# EAGLE design main (EAGLE 7.4.0)
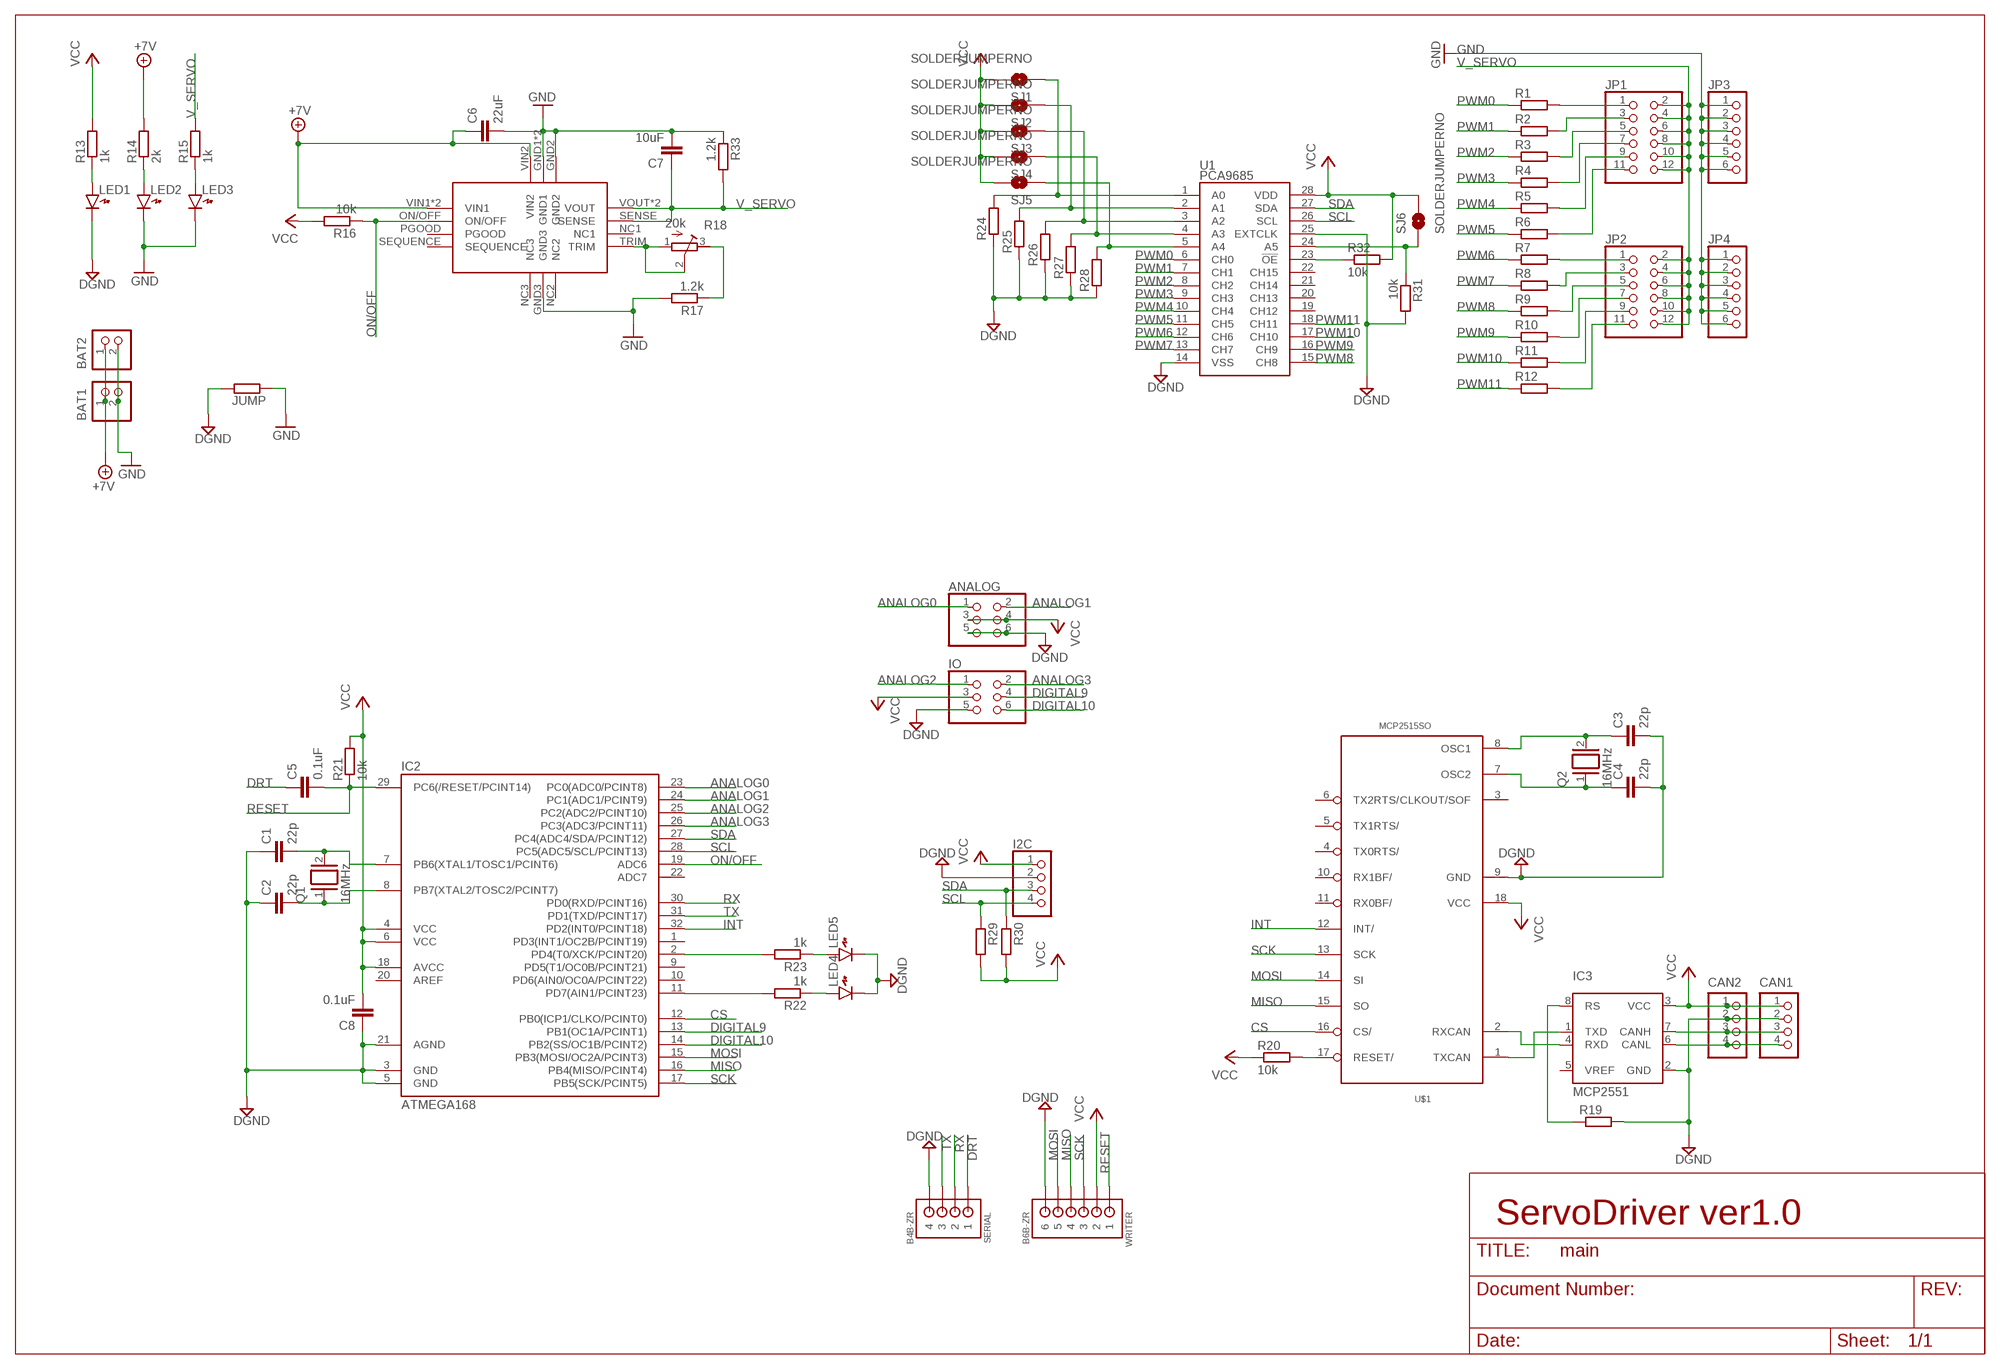
[diagram p0: schematic, sheet 1]

## Parts
ANALOG  PINHD-2X3  [2X03]
BAT1  B2P-VH  [B2P-VH]
BAT2  B2P-VH  [B2P-VH]
C1  22p  C-EUC2012  [C2012]
C2  22p  C-EUC2012  [C2012]
C3  22p  C-EUC2012  [C2012]
C4  22p  C-EUC2012  [C2012]
C5  0.1uF  C-EUC2012  [C2012]
C6  22uF  C-EUC2012  [C2012]
C7  10uF  C-EUC2012  [C2012]
C8  0.1uF  C-EUC2012  [C2012]
CAN1  B4B-PH-K-S  [B4B-PH-K-S]
CAN2  B4B-PH-K-S  [B4B-PH-K-S]
I2C  PINHD-1X4  [1X04]
IC1  OKL-T  [OKL-T]
IC2  ATMEGA168  ATMEGA48/88/168-AU  [TQFP32-08]
IC3  MCP2551  [SOIC]
IO  PINHD-2X3  [2X03]
JP1  PINHD-2X6  [2X06]
JP2  PINHD-2X6  [2X06]
JP3  PINHD-1X6  [1X06]
JP4  PINHD-1X6  [1X06]
JUMP  R-EU_M2012  [M2012]
LED1  LED2012  [LED2012]
LED2  LED2012  [LED2012]
LED3  LED2012  [LED2012]
LED4  LED2012  [LED2012]
LED5  LED2012  [LED2012]
Q1  16MHz  XTAL/S  [QS]
Q2  16MHz  XTAL/S  [QS]
R1  R-EU_M2012  [M2012]
R2  R-EU_M2012  [M2012]
R3  R-EU_M2012  [M2012]
R4  R-EU_M2012  [M2012]
R5  R-EU_M2012  [M2012]
R6  R-EU_M2012  [M2012]
R7  R-EU_M2012  [M2012]
R8  R-EU_M2012  [M2012]
R9  R-EU_M2012  [M2012]
R10  R-EU_M2012  [M2012]
R11  R-EU_M2012  [M2012]
R12  R-EU_M2012  [M2012]
R13  1k  R-EU_M2012  [M2012]
R14  2k  R-EU_M2012  [M2012]
R15  1k  R-EU_M2012  [M2012]
R16  10k  R-EU_M2012  [M2012]
R17  1.2k  R-EU_M2012  [M2012]
R18  20k  R-TRIMM64W  [RTRIM64W]
R19  R-EU_M2012  [M2012]
R20  10k  R-EU_M2012  [M2012]
R21  10k  R-EU_M2012  [M2012]
R22  1k  R-EU_M2012  [M2012]
R23  1k  R-EU_M2012  [M2012]
R24  R-EU_M2012  [M2012]
R25  R-EU_M2012  [M2012]
R26  R-EU_M2012  [M2012]
R27  R-EU_M2012  [M2012]
R28  R-EU_M2012  [M2012]
R29  R-EU_M2012  [M2012]
R30  R-EU_M2012  [M2012]
R31  10k  R-EU_M2012  [M2012]
R32  10k  R-EU_M2012  [M2012]
R33  1.2k  R-EU_M2012  [M2012]
SERIAL  B4B-ZR  [B4B-ZR]
SJ1  SOLDERJUMPERNO  [SJ_2S-NO]
SJ2  SOLDERJUMPERNO  [SJ_2S-NO]
SJ3  SOLDERJUMPERNO  [SJ_2S-NO]
SJ4  SOLDERJUMPERNO  [SJ_2S-NO]
SJ5  SOLDERJUMPERNO  [SJ_2S-NO]
SJ6  SOLDERJUMPERNO  [SJ_2S-NO]
U1  PCA9685  [TSSOP-28_4MM]
U$1  MCP2515SO  [SO18L]
WRITER  B6B-ZR  [B6B-ZR]

## Nets
+7V: BAT1.1 BAT2.1 C6.1 IC1.VIN1 IC1.VIN2 IC1.VIN_BRIDGE(VIN1) R14.2
ANALOG0: ANALOG.1 IC2.23(PC0(ADC0/PCINT8))
ANALOG1: ANALOG.2 IC2.24(PC1(ADC1/PCINT9))
ANALOG2: IC2.25(PC2(ADC2/PCINT10)) IO.1
ANALOG3: IC2.26(PC3(ADC3/PCINT11)) IO.2
CS: IC2.12(PB0(ICP1/CLKO/PCINT0)) U$1.16(CS/)
DGND: ANALOG.5 ANALOG.6 C1.1 C2.1 C3.2 C4.2 C8.1 CAN1.2 CAN2.2 I2C.2 IC2.3(GND) IC2.5(GND) IC2.21(AGND) IC3.2(GND) IO.5 JUMP.2 LED1.K LED4.K LED5.K R19.2 R24.1 R25.1 R26.1 R27.1 R28.1 R31.2 SERIAL.4 U1.14(VSS) U1.25(EXTCLK) U$1.9(GND) WRITER.6
DIGITAL9: IC2.13(PB1(OC1A/PCINT1)) IO.4
DIGITAL10: IC2.14(PB2(SS/OC1B/PCINT2)) IO.6
DRT: C5.1 SERIAL.1
GND: BAT1.2 BAT2.2 C6.2 C7.2 IC1.GND1 IC1.GND2 IC1.GND3 IC1.GND_BRIDGE(GND1) JP3.1 JP3.2 JP3.3 JP3.4 JP3.5 JP3.6 JP4.1 JP4.2 JP4.3 JP4.4 JP4.5 JP4.6 JUMP.1 LED2.K LED3.K R17.2 R33.1
INT: IC2.32(PD2(INT0/PCINT18)) U$1.12(INT/)
MISO: IC2.16(PB4(MISO/PCINT4)) U$1.15(SO) WRITER.4
MOSI: IC2.15(PB3(MOSI/OC2A/PCINT3)) U$1.14(SI) WRITER.5
N$1: JP1.1 R1.2
N$2: JP1.3 R2.2
N$3: JP1.5 R3.2
N$4: JP1.7 R4.2
N$5: JP1.9 R5.2
N$6: JP1.11 R6.2
N$7: JP2.1 R7.2
N$8: JP2.3 R8.2
N$9: JP2.5 R9.2
N$10: JP2.7 R10.2
N$11: JP2.9 R11.2
N$12: JP2.11 R12.2
N$13: LED1.A R13.1
N$14: LED2.A R14.1
N$15: LED3.A R15.1
N$16: IC1.TRIM R18.1(A) R18.2(S)
N$17: R17.1 R18.3(E)
N$18: C2.2 IC2.8(PB7(XTAL2/TOSC2/PCINT7)) Q1.1
N$19: R24.2 SJ1.1 U1.1(A0)
N$20: C1.2 IC2.7(PB6(XTAL1/TOSC1/PCINT6)) Q1.2
N$21: IC3.1(TXD) U$1.1(TXCAN)
N$22: IC3.4(RXD) U$1.2(RXCAN)
N$23: IC3.8(RS) R19.1
N$24: CAN1.3 CAN2.3 IC3.7(CANH)
N$25: CAN1.4 CAN2.4 IC3.6(CANL)
N$26: C4.1 Q2.1 U$1.7(OSC2)
N$27: C3.1 Q2.2 U$1.8(OSC1)
N$28: R25.2 SJ2.1 U1.2(A1)
N$29: R26.2 SJ3.1 U1.3(A2)
N$30: R27.2 SJ4.1 U1.4(A3)
N$31: IC2.2(PD4(T0/XCK/PCINT20)) R23.2
N$32: R28.2 SJ5.1 U1.5(A4)
N$33: R32.1 U1.23(!OE)
N$34: R20.2 U$1.17(RESET/)
N$35: IC2.11(PD7(AIN1/PCINT23)) R22.2
N$36: LED4.A R22.1
N$37: LED5.A R23.1
N$39: R31.1 SJ6.1 U1.24(A5)
ON/OFF: IC1.ON/OFF IC2.19(ADC6) R16.1
PWM0: R1.1 U1.6(CH0)
PWM1: R2.1 U1.7(CH1)
PWM2: R3.1 U1.8(CH2)
PWM3: R4.1 U1.9(CH3)
PWM4: R5.1 U1.10(CH4)
PWM5: R6.1 U1.11(CH5)
PWM6: R7.1 U1.12(CH6)
PWM7: R8.1 U1.13(CH7)
PWM8: R9.1 U1.15(CH8)
PWM9: R10.1 U1.16(CH9)
PWM10: R11.1 U1.17(CH10)
PWM11: R12.1 U1.18(CH11)
RESET: C5.2 IC2.29(PC6(/RESET/PCINT14)) R21.1 WRITER.1
RX: IC2.30(PD0(RXD/PCINT16)) SERIAL.2
SCK: IC2.17(PB5(SCK/PCINT5)) U$1.13(SCK) WRITER.3
SCL: I2C.4 IC2.28(PC5(ADC5/SCL/PCINT13)) R29.1 U1.26(SCL)
SDA: I2C.3 IC2.27(PC4(ADC4/SDA/PCINT12)) R30.1 U1.27(SDA)
TX: IC2.31(PD1(TXD/PCINT17)) SERIAL.3
V_SERVO: C7.1 IC1.SENSE IC1.VOUT IC1.VOUT_BRIDGE(VOUT) JP1.2 JP1.4 JP1.6 JP1.8 JP1.10 JP1.12 JP2.2 JP2.4 JP2.6 JP2.8 JP2.10 JP2.12 R15.2 R33.2
VCC: ANALOG.3 ANALOG.4 C8.2 CAN1.1 CAN2.1 I2C.1 IC2.4(VCC) IC2.6(VCC) IC2.18(AVCC) IC3.3(VCC) IO.3 R13.2 R16.2 R20.1 R21.2 R29.2 R30.2 R32.2 SJ1.2 SJ2.2 SJ3.2 SJ4.2 SJ5.2 SJ6.2 U1.28(VDD) U$1.18(VCC) WRITER.2
Unconnected: IC1.NC1 IC1.NC2 IC1.NC3 IC1.PGOOD IC1.SEQUENCE IC2.1(PD3(INT1/OC2B/PCINT19)) IC2.9(PD5(T1/OC0B/PCINT21)) IC2.10(PD6(AIN0/OC0A/PCINT22)) IC2.20(AREF) IC2.22(ADC7) IC3.5(VREF) U1.19(CH12) U1.20(CH13) U1.21(CH14) U1.22(CH15) U$1.3(CLKOUT/SOF) U$1.4(TX0RTS/) U$1.5(TX1RTS/) U$1.6(TX2RTS/) U$1.10(RX1BF/) U$1.11(RX0BF/)

## Notes on the sheet
- ServoDriver ver1.0

## Library data of the parts
ANALOG IO = pinhead:PINHD-2X3: PIN HEADER
BAT1 BAT2 = jst-vh:B2P-VH: Wire-to-Board 3.96mm pitch top mount connector Source: http://www.jst-mfg.com/product/pdf/jpn/VH.pdf http://www.jst-mfg.com/product/detail.php?series=262
C1-C8 = resistor:C-EU: CAPACITOR, European symbol
CAN1 CAN2 = jst-ph:B4B-PH-*: Wire-to-Board 2.0mm pitch top mount connector Source: http://www.jst-mfg.com/product/pdf/jpn/PH.pdf http://www.jst-mfg.com/product/detail.php?series=199
I2C = pinhead:PINHD-1X4: PIN HEADER
IC1 = OKL-T:OKL-T
IC2 = atmega8:ATMEGA48/88/168
IC3 = mcp2551:MCP2551
JP1 JP2 = pinhead:PINHD-2X6: PIN HEADER
JP3 JP4 = pinhead:PINHD-1X6: PIN HEADER
JUMP R1-R17 R19-R33 = resistor:R-EU_: RESISTOR, European symbol
LED1-LED5 = generic:LED: Generic LEDs
Q1 Q2 = special:XTAL/S: CRYSTAL
R18 = resistor:R-TRIMM: Trimm resistor
SERIAL = jst:B4B-ZR: JST-ZH Connector 4 pol, 1.5mm pitch Package: B4B-ZR Source: http://www.jst-mfg.com/product/pdf/eng/eZH.pdf
SJ1-SJ6 = SparkFun-Retired:SOLDERJUMPER: Solder Jumper Standard SMD solder jumper. Used to automate production. Two varients : Normally Open and Normally Closed are the same, but have different paste layers. NC will have a large amount of paste and should jumper during reflow.
U1 = SparkFun-DigitalIC:PCA9685: 16-channel 12-bit PWM I2C interface Internal Oscillator 40Hz to 1kHz Can be totem pole or open collector 2.3V to 5.5V; PROD_ID: IC-12240
U$1 = MCP2515_MT:MCP2515*: MCP2515 Standalone CAN-Controller by Microchip Eagle-Lib. by MartinThomas
WRITER = jst:B6B-ZR: JST-ZH Connector 6 pol, 1.5mm pitch Package: B6B-ZR Source: http://www.jst-mfg.com/product/pdf/eng/eZH.pdf

## Board
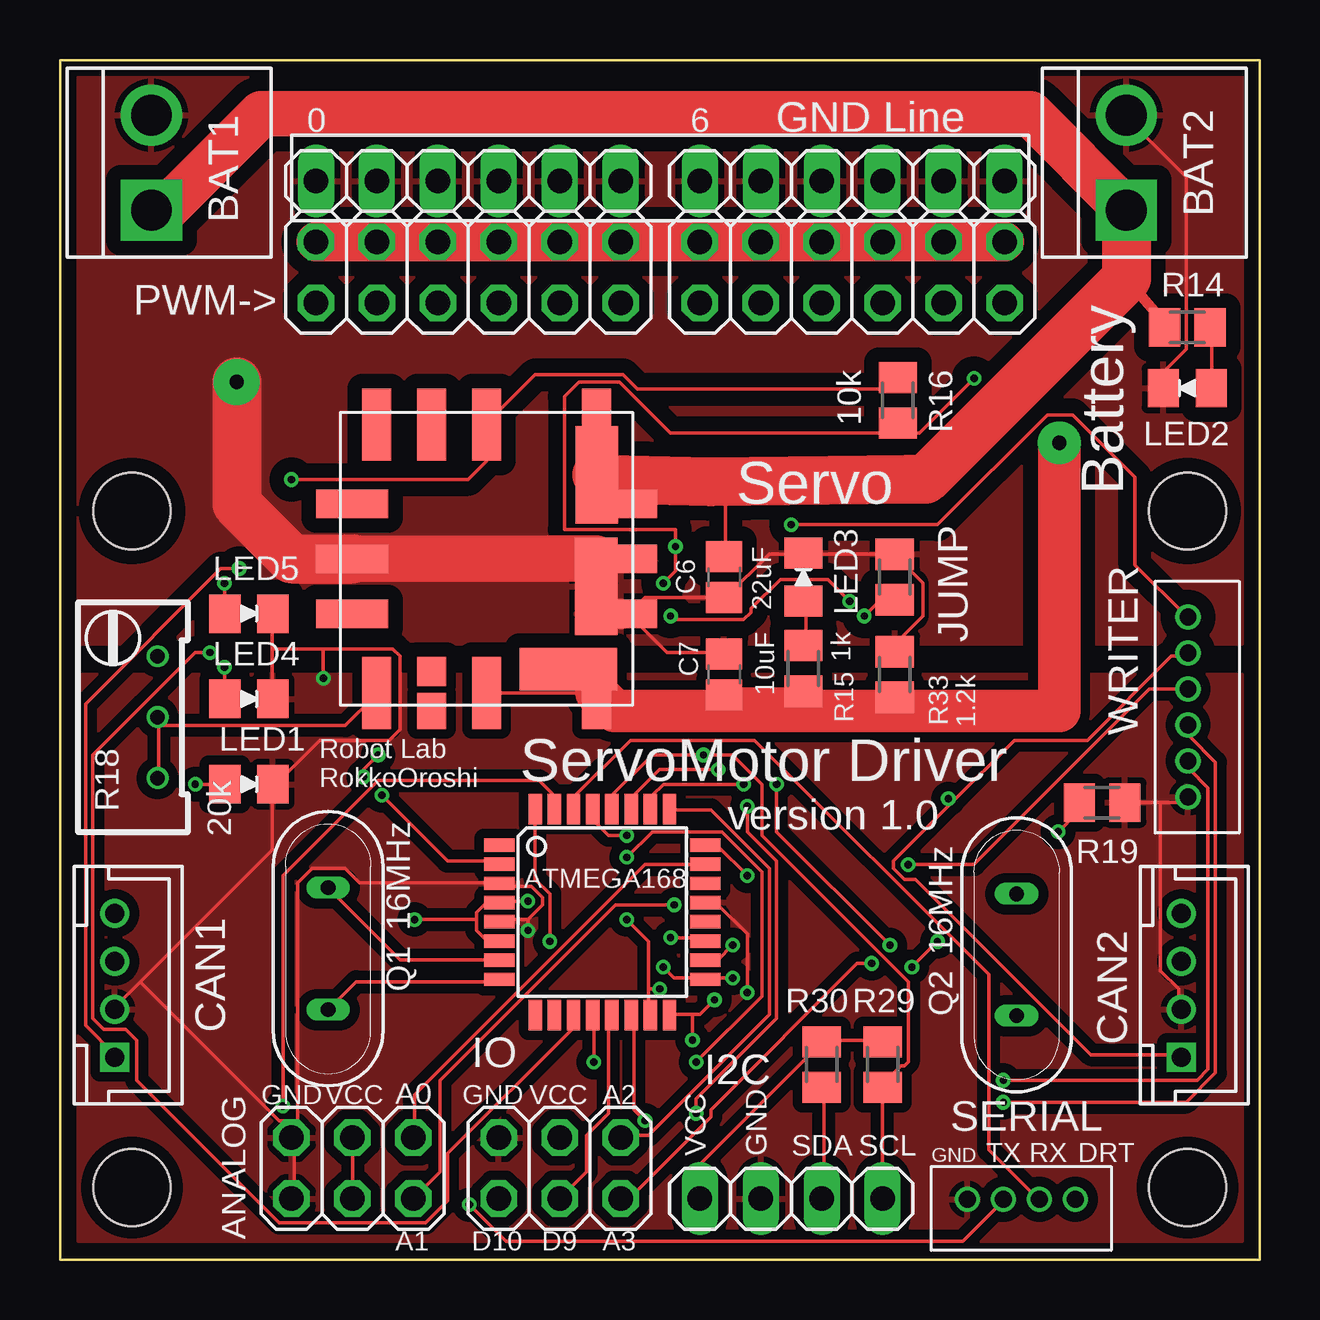
[diagram p1: board, top side]
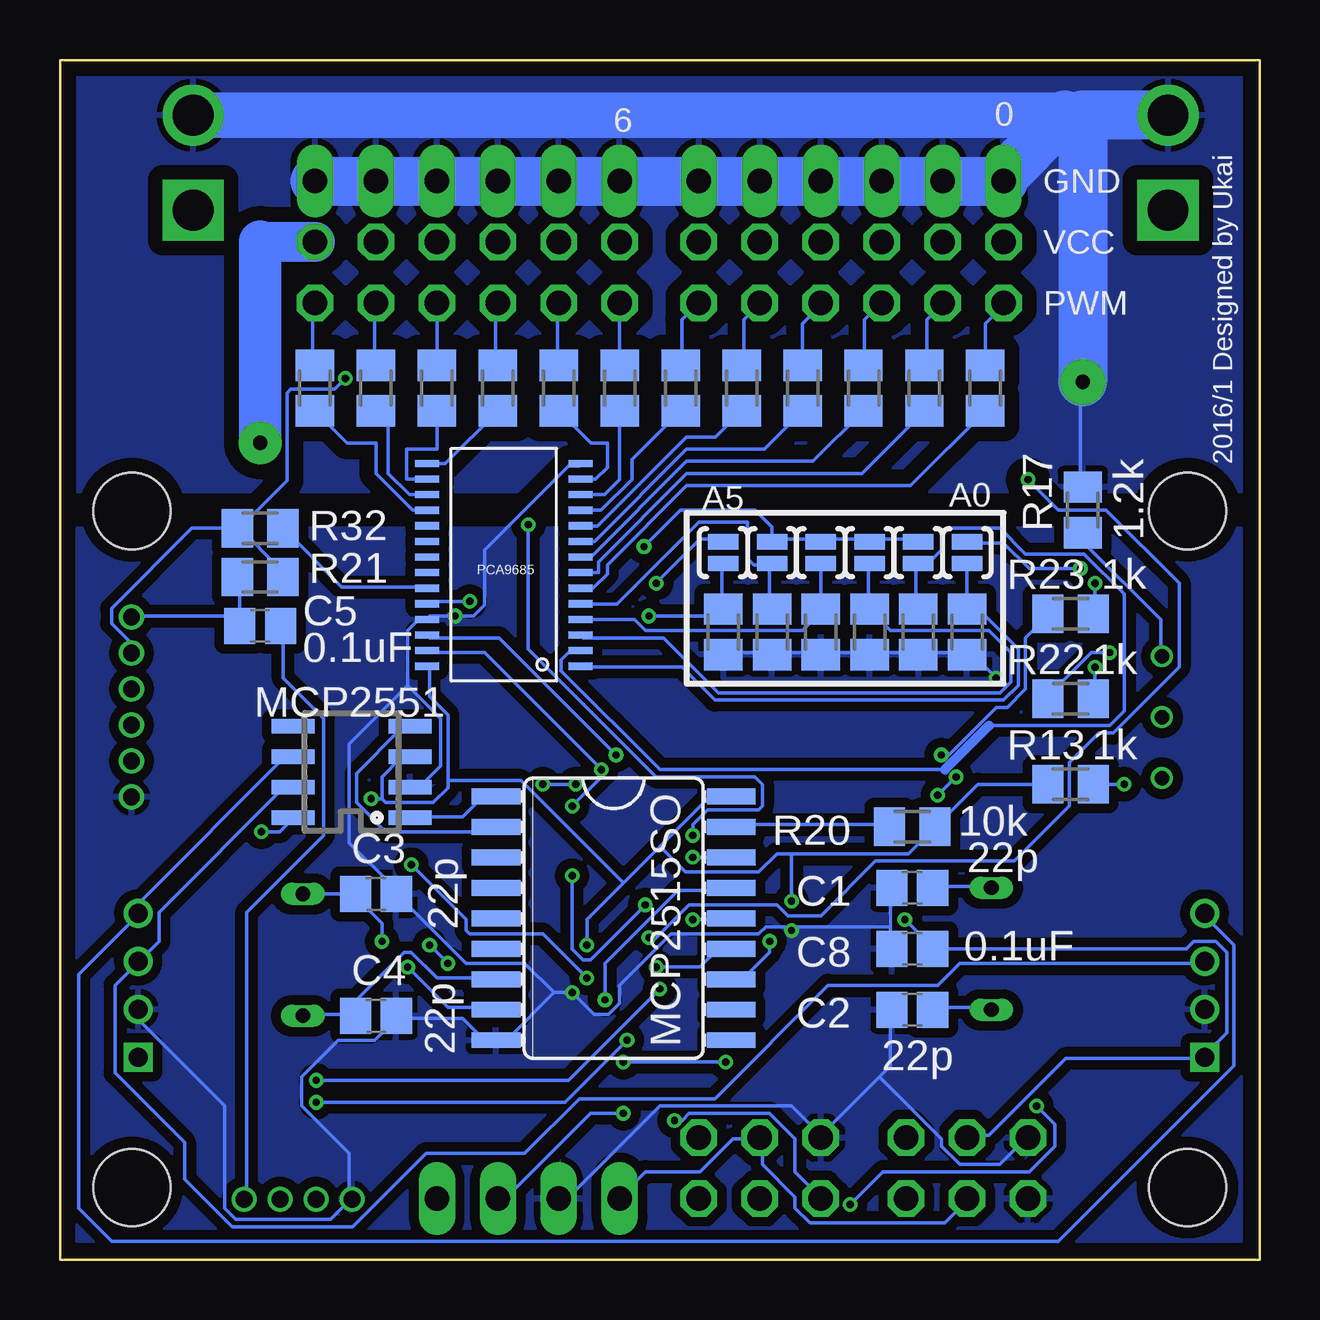
[diagram p2: board, bottom side, seen from below]

Size 50 x 50 mm. Coordinates in mm from the lower left corner, seen from the top.
Outline: 0,0 3,0 47,0 50,0 50,50 0,50 0,31.2 0,0
Copper layers (1*16): Top 0.035mm / dielectric 1.6mm / Bottom 0.035mm
Design rules "Elecrow_2-layer_PCB_eagle_rule": minimum track width 6mil, minimum drill 12mil, track to track 6mil, track to pad 6mil, pad to pad 6mil, via to via 8mil, smd to smd 0mil, copper to edge 20mil, drill to drill 10mil, minimum pad ring 6mil, minimum via ring 6mil, stop-mask expansion 0mil, vias tented up to drill 100mil, thermal gap 10mil
Holes 3.2 mm at 3,3 47,3 3,31.2 47,31.2

### Footprints (pad centres in the part's own frame; a part is rotated, then mirrored left to right if it is on the bottom)
2X03 = drill 1.016 octagon: 1 -2.54,-1.27; 2 -2.54,1.27; 3 0,-1.27; 4 0,1.27; 5 2.54,-1.27; 6 2.54,1.27
B2P-VH = drill 1.7 square: 1 -1.98,0 | drill 1.7: 2 1.98,0
C2012 = smd 1.3 x 1.5: 1 -0.85,0; 2 0.85,0
B4B-PH-K-S = drill 0.8 square: 1 -3,0 | drill 0.8: 2 -1,0; 3 1,0; 4 3,0
1X04 = drill 1.016 long: 1 -3.81,0; 2 -1.27,0; 3 1.27,0; 4 3.81,0
OKL-T = smd 1.2 x 3: GND1 6.1,11.7; GND2 8.39,11.7; GND3 6.1,0.5; NC2 8.39,0.5; NC3 3.81,0.5; VIN2 3.81,11.7 | smd 4.07 x 1.77: GND_BRIDGE 7.245,10.68; VIN_BRIDGE 2.6,10.7 | smd 1.2 x 1.2: NC1 10.8,3.81 | smd 1.5 x 1.2: NC_BRIDGE 12.45,3.81 | smd 3 x 1.2: ON/OFF 0.5,6.1; PGOOD 0.5,3.81; SENSE 11.7,6.1; SEQUENCE 0.5,1.52; TRIM 11.7,1.52; VIN1 0.5,10.68; VOUT 11.7,10.68 | smd 1.77 x 4.07: VOUT_BRIDGE 10.7,9.5
TQFP32-08 = smd 1.27 x 0.559: 1 -4.293,2.8; 2 -4.293,2; 3 -4.293,1.2; 4 -4.293,0.4; 5 -4.293,-0.4; 6 -4.293,-1.2; 7 -4.293,-2; 8 -4.293,-2.8; 17 4.293,-2.8; 18 4.293,-2; 19 4.293,-1.2; 20 4.293,-0.4; 21 4.293,0.4; 22 4.293,1.2; 23 4.293,2; 24 4.293,2.8 | smd 0.559 x 1.27: 9 -2.8,-4.293; 10 -2,-4.293; 11 -1.2,-4.293; 12 -0.4,-4.293; 13 0.4,-4.293; 14 1.2,-4.293; 15 2,-4.293; 16 2.8,-4.293; 25 2.8,4.293; 26 2,4.293; 27 1.2,4.293; 28 0.4,4.293; 29 -0.4,4.293; 30 -1.2,4.293; 31 -2,4.293; 32 -2.8,4.293
SOIC = smd 0.6 x 1.8: 1 -1.905,-2.44; 2 -0.635,-2.44; 3 0.635,-2.44; 4 1.905,-2.44; 5 1.905,2.44; 6 0.635,2.44; 7 -0.635,2.44; 8 -1.905,2.44
2X06 = drill 1.016 octagon: 1 -6.35,-1.27; 2 -6.35,1.27; 3 -3.81,-1.27; 4 -3.81,1.27; 5 -1.27,-1.27; 6 -1.27,1.27; 7 1.27,-1.27; 8 1.27,1.27; 9 3.81,-1.27; 10 3.81,1.27; 11 6.35,-1.27; 12 6.35,1.27
1X06 = drill 1.016 long: 1 -6.35,0; 2 -3.81,0; 3 -1.27,0; 4 1.27,0; 5 3.81,0; 6 6.35,0
M2012 = smd 1.3 x 1.6: 1 -0.95,0; 2 0.95,0
LED2012 = smd 1.3 x 1.6: A -1,0; K 1,0
QS = drill 0.61 long: 1 -2.54,0; 2 2.54,0
RTRIM64W = drill 0.61: 1 1.27,-2.54; 2 1.27,0; 3 1.27,2.54
B4B-ZR = drill 0.7: 1 6,-1.3; 2 4.5,-1.3; 3 3,-1.3; 4 1.5,-1.3
SJ_2S-NO = smd 0.635 x 1.27: 1 -0.45,0; 2 0.45,0
TSSOP-28_4MM = smd 1 x 0.3: 1 -3.2,4.225; 2 -3.2,3.575; 3 -3.2,2.925; 4 -3.2,2.275; 5 -3.2,1.625; 6 -3.2,0.975; 7 -3.2,0.325; 8 -3.2,-0.325; 9 -3.2,-0.975; 10 -3.2,-1.625; 11 -3.2,-2.275; 12 -3.2,-2.925; 13 -3.2,-3.575; 14 -3.2,-4.225; 15 3.2,-4.225; 16 3.2,-3.575; 17 3.2,-2.925; 18 3.2,-2.275; 19 3.2,-1.625; 20 3.2,-0.975; 21 3.2,-0.325; 22 3.2,0.325; 23 3.2,0.975; 24 3.2,1.625; 25 3.2,2.275; 26 3.2,2.925; 27 3.2,3.575; 28 3.2,4.225
SO18L = smd 0.66 x 2.032: 1 -5.08,-4.902; 2 -3.81,-4.902; 3 -2.54,-4.902; 4 -1.27,-4.902; 5 0,-4.902; 6 1.27,-4.902; 7 2.54,-4.902; 8 3.81,-4.902; 9 5.08,-4.902; 10 5.08,4.902; 11 3.81,4.902; 12 2.54,4.902; 13 1.27,4.902; 14 0,4.902; 15 -1.27,4.902; 16 -2.54,4.902; 17 -3.81,4.902; 18 -5.08,4.902
B6B-ZR = drill 0.7: 1 9,-1.3; 2 7.5,-1.3; 3 6,-1.3; 4 4.5,-1.3; 5 3,-1.3; 6 1.5,-1.3

### Placement (x,y rotation side)
ANALOG  12.19,3.81 180 top
BAT1  3.81,45.72 90 top
BAT2  44.45,45.72 90 top
C1  14.48,15.49 0 bottom
C2  14.48,10.41 0 bottom
C3  36.83,15.24 0 bottom
C4  36.83,10.16 0 bottom
C5  41.66,26.42 180 bottom
C6  27.69,28.45 270 top
C7  27.69,24.38 90 top
C8  14.48,12.95 0 bottom
CAN1  2.29,11.43 90 top
CAN2  46.74,11.43 90 top
I2C  30.48,2.54 0 top
IC1  11.68,35.31 270 top
IC2  22.61,14.48 0 top
IC3  37.85,20.32 90 bottom
IO  20.83,3.81 180 top
JP1  17.02,41.15 0 top
JP2  33.02,41.15 0 top
JP3  17.02,44.96 0 top
JP4  33.02,44.96 0 top
JUMP  34.8,28.45 270 top
LED1  7.87,19.81 0 top
LED2  46.99,36.32 180 top
LED3  30.99,28.45 90 top
LED4  7.87,23.37 0 top
LED5  7.87,26.92 0 top
Q1  11.18,12.95 90 top
Q2  39.88,12.7 90 top
R1  11.43,36.32 90 bottom
R2  13.97,36.32 90 bottom
R3  16.51,36.32 90 bottom
R4  19.05,36.32 90 bottom
R5  21.59,36.32 90 bottom
R6  24.13,36.32 90 bottom
R7  26.67,36.32 90 bottom
R8  29.21,36.32 90 bottom
R9  31.75,36.32 90 bottom
R10  34.29,36.32 90 bottom
R11  36.83,36.32 90 bottom
R12  39.37,36.32 90 bottom
R13  7.87,19.81 180 bottom
R14  46.99,38.86 180 top
R15  30.99,24.64 270 top
R16  34.92,35.81 270 top
R17  7.37,31.24 90 bottom
R18  2.79,22.61 0 top
R19  43.43,19.05 0 top
R20  14.48,18.03 180 bottom
R21  41.66,28.45 0 bottom
R22  7.87,23.37 180 bottom
R23  7.87,26.92 180 bottom
R24  12.19,26.16 90 bottom
R25  14.22,26.16 90 bottom
R26  16.26,26.16 90 bottom
R27  18.29,26.16 90 bottom
R28  20.32,26.16 90 bottom
R29  34.29,8.13 90 top
R30  31.75,8.13 90 top
R31  22.35,26.16 270 bottom
R32  41.66,30.48 180 bottom
R33  34.8,24.38 270 top
SERIAL  36.32,3.81 0 top
SJ1  12.19,29.46 90 bottom
SJ2  14.22,29.46 90 bottom
SJ3  16.26,29.46 90 bottom
SJ4  18.29,29.46 90 bottom
SJ5  20.32,29.46 90 bottom
SJ6  22.35,29.46 90 bottom
U1  31.5,28.96 180 bottom
U$1  26.92,14.22 270 bottom
WRITER  45.72,17.78 90 top

### Tracks (layer width: path | path; a pad name or v marks a point on that pad's centre or on a via)
+7V
  Top 0.152: C6.1 27.74,29.41 27.74,31.7 27.12,32.41
  Top 0.406: 35.05,32.77 35.31,32.51 35.05,32.26 | R14.2 46.04,39.05 44.45,40.89
  Top 0.813: IC1.VIN_BRIDGE 22.38,32.75 IC1.VIN2 | 22.82,32.51 22.44,33.96 IC1.VIN1
  Top 1.905: BAT1.1 4.37,43.74 8.38,47.75 40.44,47.75 BAT2.1
  Top 2.032: BAT2.1 44.45,40.89 36.07,32.51 35.31,32.51 27.12,32.41 22.82,32.51 IC1.VIN_BRIDGE
ANALOG0
  Top 0.152: IC2.23 26.82,16.46 24.38,16.46 14.78,6.86 14.78,5.18 ANALOG.1
ANALOG1  (via drill 0.3)
  Top 0.152: v28.65,16 27.43,17.22 26.98,17.22 IC2.24 | v25.6,14.78 23.16,14.78 15.85,7.47 15.85,3.66 ANALOG.2
  Bottom 0.152: v28.65,16 28.65,12.95 28.19,12.5 27.89,12.5 v25.6,14.78
ANALOG2
  Top 0.152: IC2.25 25.45,18.75 27.13,18.75 29.57,16.31 29.57,10.21 24.54,5.18 23.47,5.18 IO.1
ANALOG3  (via drill 0.3)
  Top 0.152: v28.5,19.81 25.15,19.81 24.69,19.36 24.69,18.9 IC2.26 | v29.87,19.81 29.87,17.83 v34.59,13.11 | v33.83,12.34 33.22,12.34 27.13,6.25 27.13,5.94 23.77,2.59 23.47,2.59 IO.2
  Bottom 0.152: v29.87,19.81 v28.5,19.81 | v33.83,12.34 v34.59,13.11
CS  (via drill 0.3)
  Top 0.152: v22.25,8.23 22.25,10.06 IC2.12 | v26.52,8.23 29.26,10.97 29.26,16.15 27.58,17.83 24.69,17.83 v23.62,16.76
  Bottom 0.152: v26.52,8.23 v22.25,8.23 | U$1.16 v23.62,16.76
DGND  (via drill 0.3)
  Top 0.152: 19.51,14.17 18.44,14.17 IC2.5 | 19.51,14.17 20.12,14.78 20.12,15.09 19.66,15.54 18.44,15.54 IC2.3 18.29,15.7 12.5,15.7 11.89,16.31 10.52,16.31 9.91,15.7 9.91,5.79 | 9.91,5.79 9.91,5.33 ANALOG.5 | ANALOG.6 9.75,2.59 9.75,5.03 ANALOG.5 | 8.84,25.45 8.84,26.82 LED5.K | 8.84,25.45 8.84,23.47 LED4.K | 3.35,11.58 2.29,10.52 CAN1.2 | 3.35,11.58 8.84,17.07 8.84,19.81 LED1.K 8.99,19.81 10.82,21.64 13.72,21.64 14.17,22.1 14.17,25.15 13.87,25.45 10.97,25.45 | 10.97,25.45 8.84,25.45 | 10.97,25.45 v10.97,24.23 | 9.91,5.79 9.14,5.79 3.35,11.58 | 9.91,5.79 ANALOG.5 | v33.53,26.82 34.14,27.43 34.75,27.43 JUMP.2 | 45.87,19.05 46.79,19.05 46.94,19.2 WRITER.6 | 45.87,19.05 R19.2 | 45.87,19.05 45.87,12.04 46.63,11.28 46.63,10.52 CAN2.2 | v28.65,11.12 28.65,13.56 27.43,14.78 26.98,14.78 IC2.21 | v19.51,13.72 19.51,14.17
  Bottom 0.152: 18.29,5.18 15.85,7.62 | 15.85,7.62 15.39,8.08 15.39,10.36 C2.1 | 18.29,5.18 19.51,6.4 24.99,6.4 28.8,2.59 29.11,2.59 I2C.2 | 18.29,5.18 IO.5 | 15.85,7.62 13.26,5.03 13.26,4.72 12.5,3.96 10.82,3.96 9.75,5.03 ANALOG.5 | R31.2 22.25,25.3 20.42,25.3 R28.1 20.27,25.3 18.29,25.3 | 18.29,25.3 16.31,25.3 R26.1 16.15,25.3 14.33,25.3 R25.1 14.17,25.3 12.19,25.3 R24.1 12.19,25.15 11.89,25.15 v10.97,24.23 | 18.29,25.3 R27.1 | 35.51,23.93 35.51,26.21 35.05,26.67 34.75,26.67 U1.25 34.59,26.82 v33.53,26.82 32.77,26.82 32.31,27.28 32.31,29.57 28.8,33.07 28.35,33.07 U1.14 | 35.51,23.93 34.14,22.55 34.14,20.57 34.9,19.81 35.36,19.81 IC3.2 | 15.39,13.87 15.39,15.39 C1.1 | 15.39,13.87 15.39,12.95 C8.1 | 29.41,11.12 v28.65,11.12 27.74,10.21 27.13,10.21 26.67,10.67 26.67,11.43 24.54,13.56 20.88,13.56 20.57,13.87 19.51,13.87 | 29.41,11.12 31.39,9.14 U$1.9 32.31,9.14 33.22,10.06 35.97,10.06 | 29.41,11.12 30.63,12.34 33.07,12.34 35.97,15.24 C3.2 36.12,15.24 36.12,15.54 37.95,17.37 37.95,21.49 35.51,23.93 | 35.97,10.06 36.88,9.14 38.41,9.14 39.93,7.62 39.93,6.4 37.95,4.42 37.95,2.59 SERIAL.4 37.95,2.44 38.71,1.68 42.67,1.68 43.13,2.13 43.13,6.4 46.63,9.91 46.63,10.36 CAN2.2 | 35.97,10.06 C4.2 | 19.51,13.87 15.39,13.87 | 19.51,13.87 v19.51,13.72
  pour Top (isolate 0.406): 0.76,0.76 49.28,0.76 49.28,24.38 0.76,24.38
  pour Bottom (isolate 0.406): 0.76,30.48 49.28,30.48 49.28,25.4 49.28,0.76 0.76,0.76
DIGITAL9
  Top 0.152: IO.4 21.95,3.66 21.95,5.18 22.86,6.1 22.86,10.06 IC2.13
DIGITAL10  (via drill 0.3)
  Top 0.152: v24.38,5.79 23.93,6.25 23.93,10.06 IC2.14
  Bottom 0.152: v24.38,5.79 24.08,5.79 23.77,6.1 20.42,6.1 19.36,5.03 19.36,3.66 18.29,2.59 IO.6
DRT
  Bottom 0.152: C5.1 40.69,26.36 40.69,24.23 39.01,22.55 39.01,17.68 42.22,14.48 42.22,2.59 SERIAL.1
GND  (via drill 0.6 pad 1.93)
  Top 0.152: IC1.GND1 22.35,29.21 22.36,29.2 IC1.GND_BRIDGE | R33.1 34.9,25.45 34.9,25.76 35.97,26.82 35.97,28.19 34.9,29.26 JUMP.1 34.75,29.41 31.09,29.41 LED3.K 30.94,29.41 29.57,29.41 27.74,27.58 C6.2 27.58,27.58 24.38,27.58 23.93,27.13 IC1.GND2 23.93,26.67 25.3,25.3 27.58,25.3 C7.2 | LED2.K 46.02,36.42 46.02,37.03 46.94,37.95 46.94,45.11 44.5,47.55 BAT2.2
  Top 1.27: IC1.GND_BRIDGE 22.36,26.92 IC1.GND2
  Top 1.93: IC1.GND3 22.35,29.21
  Top 2.032: v7.37,36.58 7.37,31.5 9.66,29.21 IC1.GND3 | 11.95,29.21 IC1.GND3 | IC1.GND3
  Bottom 0.152: R17.2 7.47,32.31 7.47,35.66 v7.37,36.58
  Bottom 1.905: BAT1.2 8.13,47.7 BAT2.2
  Bottom 2.032: BAT1.2 7.37,47.7 v7.37,36.58 | JP4.6 JP4.5 JP4.4 JP4.3 JP4.2 JP4.1 JP3.6 JP3.5 JP3.4 JP3.3 JP3.2 JP3.1 10.87,44.96 8.13,47.7
  pour Top (isolate 0.61): 0.76,49.28 49.28,49.28 49.28,25.65 0.76,25.65
  pour Bottom (isolate 0.61): 0.76,49.28 49.28,49.28 49.28,32 0.76,32
INT  (via drill 0.3)
  Top 0.152: v20.42,13.26 20.42,15.24 19.81,15.85 19.81,18.75 IC2.32
  Bottom 0.152: v20.42,13.26 20.42,12.8 21.49,11.73 21.95,11.73 U$1.12
MISO  (via drill 0.3)
  Top 0.152: 26.36,10.21 26.67,10.21 v27.28,10.82 | 26.36,10.21 25.45,10.21 IC2.16 | v39.32,6.55 46.94,6.55 48.16,7.77 48.16,20.73 47.09,21.79 47.09,22.25 WRITER.4 | 26.36,10.21 v26.36,9.14
  Bottom 0.152: v27.28,10.82 27.28,12.34 24.23,15.39 22.1,15.39 U$1.15 | v39.32,6.55 28.96,6.55 v26.36,9.14
MOSI  (via drill 0.3)
  Top 0.152: 24.54,11.28 24.54,13.26 v23.62,14.17 | 24.54,11.28 24.54,10.21 IC2.15 | v39.32,7.47 47.4,7.47 47.85,7.92 47.85,19.66 47.09,20.42 47.09,20.73 WRITER.5 | 24.54,11.28 v24.99,11.28
  Bottom 0.152: v23.62,14.17 22.1,14.17 U$1.14 | v39.32,7.47 28.8,7.47 v24.99,11.28
N$1
  Bottom 0.152: R1.2 11.43,39.01 10.67,39.78 JP1.1
N$2
  Bottom 0.152: R2.2 13.87,37.34 13.87,39.17 13.26,39.78 JP1.3
N$3
  Bottom 0.152: JP1.5 16.46,39.17 16.46,37.34 R3.2
N$4
  Bottom 0.152: R4.2 19.05,39.01 18.29,39.78 JP1.7
N$5
  Bottom 0.152: R5.2 21.49,37.34 21.49,39.17 20.88,39.78 JP1.9
N$6
  Bottom 0.152: JP1.11 24.08,39.17 24.08,37.34 R6.2
N$7
  Bottom 0.152: JP2.1 R7.2
N$8
  Bottom 0.152: R8.2 29.26,37.34 29.26,39.78 JP2.3
N$9
  Bottom 0.152: R9.2 31.85,37.34 31.85,39.78 JP2.5
N$10
  Bottom 0.152: JP2.7 R10.2
N$11
  Bottom 0.152: R11.2 36.88,37.34 36.88,39.78 JP2.9
N$12
  Bottom 0.152: R12.2 39.47,37.34 39.47,39.78 JP2.11
N$13  (via drill 0.3)
  Top 0.152: v5.64,19.81 LED1.A
  Bottom 0.152: R13.1 v5.64,19.81
N$14
  Top 0.152: R14.1 48.01,38.86 48.01,36.42 LED2.A
N$15
  Top 0.152: R15.1 31.09,25.6 31.09,27.43 LED3.A
N$16
  Top 0.152: 4.12,22.25 4.12,22.55 R18.2 4.12,22.25 | 4.12,22.25 4.12,20.12 R18.1 | 4.12,22.25 11.89,22.25 13.11,23.47 IC1.TRIM
N$17
  Bottom 0.152: R17.1 7.32,30.18 7.32,29.87 4.12,26.67 4.12,25.15 R18.3
N$18
  Top 0.152: Q1.1 12.34,11.58 18.29,11.58 IC2.8
  Bottom 0.152: C2.2 13.56,10.52 11.28,10.52 Q1.1
N$19
  Bottom 0.152: U1.1 28.19,24.69 24.08,24.69 22.71,23.32 10.67,23.32 10.06,23.93 10.06,25.45 11.58,26.98 12.19,26.98 R24.2 SJ1.1
N$20
  Top 0.152: Q1.2 14.17,12.5 18.29,12.5 IC2.7
  Bottom 0.152: C1.2 13.56,15.54 11.28,15.54 Q1.2
N$21
  Bottom 0.152: IC3.1 35.36,18.44 33.22,18.44 32.46,19.2 31.85,19.2 U$1.1
N$22
  Bottom 0.152: IC3.4 35.51,22.1 35.81,22.1 37.64,20.27 37.64,19.05 36.42,17.83 32,17.83 31.85,17.98 U$1.2
N$23  (via drill 0.3)
  Top 0.152: v41.6,17.83 42.37,18.59 42.37,19.05 R19.1
  Bottom 0.152: v41.6,17.83 40.84,17.83 40.39,18.29 IC3.8
N$24
  Bottom 0.152: IC3.7 40.39,19.66 40.69,19.66 45.87,14.48 45.87,13.26 46.63,12.5 CAN2.3 46.79,12.34 47.7,11.43 47.7,7.77 44.81,4.88 44.81,3.35 42.82,1.37 37.8,1.37 34.75,4.42 30.63,4.42 28.35,6.71 22.71,6.71 17.98,11.43 13.41,11.43 12.5,12.34 2.29,12.34 CAN1.3
N$25
  Bottom 0.152: IC3.6 40.39,20.88 40.69,20.88 46.63,14.94 46.63,14.48 CAN2.4 46.79,14.33 49.23,11.89 49.23,2.13 47.85,0.76 8.38,0.76 1.07,8.08 1.07,13.11 2.29,14.33 CAN1.4
N$26
  Bottom 0.152: Q2.1 39.78,10.21 37.8,10.21 C4.1 37.64,10.21 37.64,10.82 35.66,12.8 35.36,12.8 34.29,11.73 31.85,11.73 U$1.7
N$27  (via drill 0.3)
  Top 0.152: v36.58,13.26 v35.51,12.19
  Bottom 0.152: Q2.2 37.8,15.24 | v35.51,12.19 33.83,10.52 31.85,10.52 U$1.8 | v36.58,13.26 36.58,14.02 37.8,15.24 | 37.8,15.24 C3.1
N$28
  Bottom 0.152: 13.11,20.42 24.99,20.42 29.11,24.54 29.11,24.99 28.8,25.3 28.35,25.3 U1.2 | 11.28,22.25 6.25,22.25 5.64,22.86 5.64,27.74 7.32,29.41 9.75,29.41 10.82,30.48 12.95,30.48 13.26,30.18 13.26,29.57 13.72,29.11 14.17,29.11 SJ2.1 14.33,28.96 14.33,27.13 R25.2
  Bottom 0.406: 11.28,22.25 13.11,20.42
N$29
  Bottom 0.152: U1.3 28.19,25.91 24.84,25.91 22.55,23.62 10.82,23.62 10.36,24.08 10.36,25.3 11.28,26.21 15.39,26.21 16.15,26.98 R26.2 16.31,27.13 16.31,28.96 SJ3.1
N$30
  Bottom 0.152: U1.4 28.19,26.67 26.06,26.67 25.6,26.21 19.05,26.21 18.29,26.98 R27.2 SJ4.1
N$31  (via drill 0.3)
  Top 0.152: v13.41,19.36 16.15,16.61 18.29,16.61 IC2.2 | v12.65,20.12 12.65,20.42 v13.26,21.03
  Bottom 0.152: v12.65,20.12 v13.41,19.36 | v13.26,21.03 12.95,21.03 10.97,23.01 10.52,23.01 9.75,23.77 9.75,25.91 8.84,26.82 R23.2
N$32
  Bottom 0.152: R28.2 20.42,27.13 20.42,28.96 SJ5.1 20.38,28.96 21.08,28.96 21.34,29.21 21.34,30.73 23.37,30.73 26.77,27.33 U1.5
N$33
  Bottom 0.152: U1.23 34.75,28.04 38.25,28.04 40.69,30.48 R32.1
N$34
  Bottom 0.152: R20.2 15.54,18.14 21.95,18.14 U$1.17
N$35  (via drill 0.3)
  Top 0.152: v6.25,25.3 5.64,25.3 1.37,21.03 1.37,10.06 1.83,9.6 2.74,9.6 3.2,9.14 3.2,7.47 9.14,1.52 15.24,1.52 16.15,2.44 16.15,4.42 21.34,9.6 21.34,10.06 IC2.11
  Bottom 0.152: v6.25,25.3 7.01,25.3 8.84,23.47 R22.2
N$36  (via drill 0.3)
  Top 0.152: v6.86,24.69 6.86,23.47 LED4.A
  Bottom 0.152: v6.86,24.69 6.86,23.47 R22.1
N$37  (via drill 0.3)
  Top 0.152: v6.86,28.19 6.86,26.98 LED5.A
  Bottom 0.152: v6.86,28.19 6.86,26.98 R23.1
N$39  (via drill 0.3)
  Top 0.152: v32.92,27.43 32,28.35 30.02,28.35 28.8,27.13 28.8,26.98 28.5,26.67 25.6,26.67 v25.45,26.82
  Bottom 0.152: v32.92,27.43 34.59,27.43 U1.24 | v25.45,26.82 22.55,26.82 22.4,26.98 R31.1 22.4,27.13 22.4,28.96 SJ6.1
ON/OFF  (via drill 0.3)
  Top 0.152: v25.45,13.41 26.82,13.41 IC2.19 | 17.68,34.44 17.68,34.75 IC1.ON/OFF | R16.1 35.05,36.27 24.08,36.27 23.47,36.88 19.81,36.88 17.83,34.9 IC1.ON/OFF | v9.65,32.51 17.02,32.51 17.78,33.27 IC1.ON/OFF
  Bottom 0.152: v25.45,13.41 25.15,13.41 23.77,14.78 20.12,14.78 19.66,14.33 18.29,14.33 16,16.61 10.21,16.61 7.92,18.9 7.92,20.73 6.71,21.95 6.1,21.95 3.35,24.69 3.35,28.19 6.4,31.24 8.38,31.24 v9.65,32.51
PWM0
  Bottom 0.152: U1.6 27.77,27.98 27.18,28.57 27.18,28.96 23.88,32.26 14.54,32.26 R1.1
PWM1
  Bottom 0.152: U1.7 27.56,28.63 27.56,29.08 23.88,32.77 16.58,32.77 R2.1
PWM2
  Bottom 0.152: U1.8 27.87,29.28 23.88,33.27 18.61,33.27 R3.1
PWM3
  Bottom 0.152: U1.9 27.73,29.93 23.88,33.78 20.64,33.78 R4.1
PWM4
  Bottom 0.152: U1.10 27.59,30.58 23.88,34.29 22.67,34.29 R5.1
PWM5
  Bottom 0.152: U1.11 27.44,31.23 26.16,32.51 26.16,33.34 R6.1
PWM6
  Bottom 0.152: U1.12 27.3,31.88 26.67,32.51 R7.1
PWM7
  Bottom 0.152: U1.13 27.67,32.53 27.18,33.02 27.18,34.04 27.87,34.04 R8.1
PWM8
  Bottom 0.152: U1.15 33.94,33.18 R9.1
PWM9
  Bottom 0.152: U1.16 35.56,32.53 35.56,33.78 34.29,33.78 R10.1
PWM10
  Bottom 0.152: U1.17 35.44,31.88 36.32,32.77 36.32,34.86 R11.1
PWM11
  Bottom 0.152: U1.18 35.3,31.23 36.83,32.77 36.83,34.04 38.03,34.04 R12.1
RESET  (via drill 0.3)
  Top 0.152: v23.62,17.68 22.86,17.68 22.25,18.29 22.25,18.75 IC2.29 | v30.48,30.63 36.58,30.63 41.15,35.2 42.22,35.2 44.81,32.61 44.81,28.96 46.94,26.82 WRITER.1
  Bottom 0.152: 42.52,26.82 42.52,28.35 R21.1 | 42.52,26.82 42.52,26.52 C5.2 42.52,26.82 | v23.62,17.68 23.62,18.14 23.01,18.75 20.88,18.75 20.73,18.9 20.73,19.81 21.03,20.12 25.15,20.12 30.48,25.45 v30.48,30.63 | 42.52,26.82 46.94,26.82 WRITER.1
RX
  Top 0.152: IC2.30 21.49,18.9 21.49,19.36 23.77,21.64 28.96,21.64 38.71,11.89 38.71,4.57 40.69,2.59 SERIAL.2
SCK  (via drill 0.3)
  Top 0.152: v25.15,12.19 25.6,11.73 26.82,11.73 IC2.17 26.98,11.73 v28.04,11.73 | v35.36,16.46 38.1,16.46 45.41,23.77 46.94,23.77 WRITER.3
  Bottom 0.152: v25.15,12.19 23.32,12.19 22.55,12.95 U$1.13 | v35.36,16.46 33.07,14.17 33.07,13.72 32.92,13.56 29.87,13.56 v28.04,11.73
SCL  (via drill 0.3)
  Top 0.152: I2C.4 R29.1 34.29,7.32 35.05,8.08 35.2,8.08 35.36,8.23 35.36,11.58 29.26,17.68 29.26,19.81 28.04,21.03 v26.82,21.03 24.69,21.03 23.01,19.36 23.01,18.9 IC2.28
  Bottom 0.152: v26.82,21.03 31.7,25.91 34.59,25.91 U1.26
SDA  (via drill 0.3)
  Top 0.152: R30.1 31.85,7.16 31.85,2.59 I2C.3 | v27.43,20.42 24.99,20.42 23.93,19.36 23.93,18.9 IC2.27 | v26.52,6.1 26.52,6.71 29.87,10.06 29.87,16.61 28.65,17.83 v28.65,18.9
  Bottom 0.152: U1.27 34.59,25.3 32.31,25.3 v27.43,20.42 27.43,20.12 v28.65,18.9 | v26.52,6.1 27.89,6.1 31.39,2.59 31.7,2.59 I2C.3
TX  (via drill 0.3)
  Top 0.152: v9.3,6.4 9.3,16 13.26,19.96 19.96,19.96 20.57,19.36 20.57,18.9 IC2.31 | v17.07,2.29 18.59,0.76 37.64,0.76 39.32,2.44 SERIAL.3
  Bottom 0.152: v9.3,6.4 8.53,5.64 8.53,4.72 9.6,3.66 15.7,3.66 v17.07,2.29
V_SERVO  (via drill 0.6 pad 1.78)
  Top 0.152: 27.74,23.62 27.74,22.86 | 27.74,23.62 27.89,23.77 30.94,23.77 R15.2 | 27.74,23.62 C7.1 | R33.2 34.9,23.47 34.9,22.86 | IC1.SENSE 17.83,23.62 21.49,23.62 IC1.VOUT 21.79,24.08 21.34,24.54 IC1.VOUT_BRIDGE
  Top 1.651: JP2.12 JP2.10 JP2.8 JP2.6 JP2.4 JP2.2 JP1.12 JP1.10 JP1.8 JP1.6 JP1.4 JP1.2
  Top 1.778: IC1.VOUT 23.11,22.86 27.74,22.86 34.9,22.86 41.66,22.86 v41.66,34.04
  Bottom 1.676: 41.66,42.42 JP2.12
  Bottom 1.778: v41.66,34.04 41.66,42.42
VCC  (via drill 0.3)
  Top 0.152: R29.2 34.29,9.14 31.85,9.14 R30.2 31.7,8.99 26.67,3.96 I2C.1 | ANALOG.3 ANALOG.4 | 17.37,14.17 17.37,14.48 17.68,14.78 18.29,14.78 IC2.4 18.44,14.94 v19.51,14.94 | 17.37,14.17 17.37,13.72 17.68,13.41 18.29,13.41 IC2.6 | v7.47,28.8 6.71,28.8 1.07,23.16 1.07,9.75 2.29,8.53 CAN1.1 | v14.78,14.17 17.37,14.17 | v28.04,13.11 27.43,12.5 26.98,12.5 IC2.18 | 35.05,34.44 35.81,34.44 v38.1,36.73 | 35.05,34.44 25.45,34.44 23.32,36.58 21.64,36.58 21.03,35.97 21.03,30.43 25.65,30.43 v25.65,29.72 25.65,28.7 v25.15,28.19 | 35.05,34.44 R16.2 | 37.19,19.05 39.78,21.64 42.82,21.64 46.33,25.15 46.94,25.15 WRITER.2 | 37.19,19.05 34.75,16.61 34.75,16.31 35.2,15.85 35.66,15.85 42.98,8.53 46.63,8.53 CAN2.1 | 37.19,19.05 v37.03,19.2
  Bottom 0.152: I2C.1 26.67,2.59 25.6,3.66 23.32,3.66 21.95,5.03 20.88,5.03 IO.3 20.73,5.03 20.73,3.96 19.36,2.59 19.36,2.13 18.75,1.52 13.11,1.52 12.19,2.44 ANALOG.4 | v7.47,28.8 9.6,28.8 10.67,29.87 12.19,29.87 SJ1.2 | 13.56,12.95 3.05,12.95 2.74,13.26 1.83,13.26 1.37,12.8 1.37,9.45 2.29,8.53 CAN1.1 2.29,8.38 8.08,8.38 11.28,5.18 12.19,5.18 ANALOG.3 | 13.56,12.95 v14.78,14.17 | 13.56,12.95 C8.2 | R13.2 11.73,19.81 13.41,18.14 R20.1 13.56,17.98 14.63,16.92 19.51,16.92 | 33.83,19.96 33.83,19.66 34.44,19.05 36.42,19.05 36.58,19.2 | 33.83,19.96 33.83,22.71 34.59,23.47 34.59,24.69 U1.28 | 36.58,19.2 36.58,20.12 35.81,20.88 35.51,20.88 IC3.3 | v28.04,13.11 28.04,14.17 26.52,15.7 | 24.99,17.22 23.01,19.2 22.1,19.2 U$1.18 | 24.99,17.22 26.52,15.7 | 33.83,19.96 30.79,19.96 26.52,15.7 | 19.51,16.92 20.12,16.92 20.88,16.15 23.93,16.15 24.99,17.22 | SJ2.2 14.33,30.02 16.15,30.02 SJ3.2 16.31,30.02 18.29,30.02 | SJ6.2 22.25,30.02 23.32,30.02 v25.15,28.19 | 42.52,30.48 40.84,28.8 40.84,28.5 R21.2 | v38.1,36.73 38.56,36.27 40.39,36.27 40.54,36.12 40.54,32.46 42.52,30.48 | 42.52,30.48 R32.2 44.5,30.48 47.85,27.13 47.85,26.52 47.09,25.76 47.09,25.3 WRITER.2 | 18.29,30.02 SJ4.2 | v37.03,19.2 36.58,19.2 | 19.51,16.92 v19.51,14.94 | 18.29,30.02 20.21,30.02 SJ5.2 20.32,30.53 21.03,31.24 24.13,31.24 v25.65,29.72

### Text on the board
tNames: 0 | 6 | GND Line | PWM-> | Battery | Servo | Robot Lab / RokkoOroshi | ServoMotor Driver | version 1.0 | GND | VCC | A0 | GND | VCC | A2 | VCC | GND | SDA | SCL | GND | TX | RX | DRT | A1 | D10 | D9 | A3
bNames: 0 | 6 | GND | VCC | PWM | 2016/1 Designed by Ukai | A0 | A5